# EAGLE schematic MeasureCurrent (EAGLE 9.6.2)
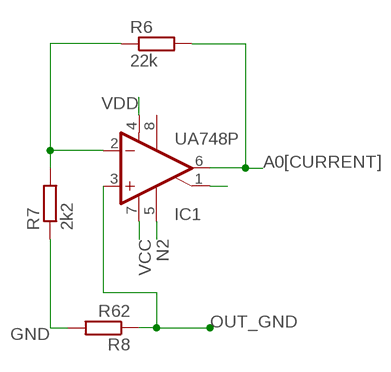
[diagram p0: schematic, sheet 1]

## Parts
IC1  UA748P  [DIL08]
R6  22k  R-EU_0207/12  [0207/12]
R7  2k2  R-EU_0207/12  [0207/12]
R8  R62  R-EU_0207/15  [0207/15]

## Nets
-IN: IC1.2(-IN) R6.1 R7.2
A0[CURRENT]: IC1.6(OUT) R6.2
GND: R7.1 R8.2
N2: IC1.5(ON)
N$4: IC1.1(ON/CMP)
OUT_GND: IC1.3(+IN) R8.1
VCC: IC1.7(V+)
VDD: IC1.4(V-)
Unconnected: IC1.8(CMP)

## Library data of the parts
IC1 = linear:*748: OP AMP
R6-R8 = rcl:R-EU_: RESISTOR, European symbol; SPICEPREFIX: R